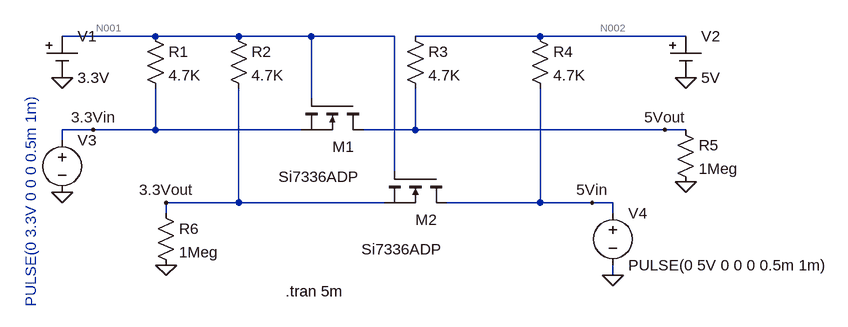
[diagram p0: schematic Logic_Level_Translator.asc]
Logic_Level_Translator.asc, the LTspice schematic file:
Version 4.1
SHEET 1 1036 680
WIRE -16 32 -160 32
WIRE 112 32 -16 32
WIRE 224 32 112 32
WIRE 352 32 224 32
WIRE 576 32 384 32
WIRE 800 32 576 32
WIRE 224 128 224 32
WIRE -112 176 -160 176
WIRE -16 176 -16 112
WIRE -16 176 -112 176
WIRE 208 176 -16 176
WIRE 384 176 384 112
WIRE 384 176 304 176
WIRE 768 176 384 176
WIRE 800 176 768 176
WIRE -160 192 -160 176
WIRE 352 240 352 32
WIRE 112 288 112 112
WIRE 112 288 0 288
WIRE 336 288 112 288
WIRE 576 288 576 112
WIRE 576 288 432 288
WIRE 656 288 576 288
WIRE 688 288 656 288
WIRE 0 304 0 288
WIRE 688 304 688 288
WIRE 688 400 688 384
FLAG 800 96 0
FLAG -160 96 0
FLAG -160 272 0
FLAG 800 256 0
FLAG 688 400 0
FLAG 0 384 0
FLAG 656 288 5Vin
FLAG -112 176 3.3Vin
FLAG 768 176 5Vout
FLAG 0 288 3.3Vout
SYMBOL nmos 304 128 R90
WINDOW 0 74 14 VRight 2
WINDOW 3 120 7 VRight 2
SYMATTR InstName M1
SYMATTR Value Si7336ADP
SYMBOL nmos 432 240 R90
WINDOW 0 74 14 VRight 2
WINDOW 3 120 7 VRight 2
SYMATTR InstName M2
SYMATTR Value Si7336ADP
SYMBOL voltage -160 176 R0
WINDOW 3 194 111 Invisible 2
WINDOW 123 0 0 Left 0
WINDOW 39 0 0 Left 0
SYMATTR InstName V3
SYMATTR Value PULSE(0 3.3V 0 0 0 0.5m 1m)
SYMBOL res -32 16 R0
SYMATTR InstName R1
SYMATTR Value 4.7K
SYMBOL res 96 16 R0
SYMATTR InstName R2
SYMATTR Value 4.7K
SYMBOL res 368 16 R0
SYMATTR InstName R3
SYMATTR Value 4.7K
SYMBOL res 560 16 R0
SYMATTR InstName R4
SYMATTR Value 4.7K
SYMBOL res 784 160 R0
SYMATTR InstName R5
SYMATTR Value 1Meg
SYMBOL Misc\\cell -160 32 R0
WINDOW 123 0 0 Left 0
WINDOW 39 0 0 Left 0
SYMATTR InstName V1
SYMATTR Value 3.3V
SYMBOL Misc\\cell 800 32 R0
WINDOW 123 0 0 Left 0
WINDOW 39 0 0 Left 0
SYMATTR InstName V2
SYMATTR Value 5V
SYMBOL voltage 688 288 R0
WINDOW 123 0 0 Left 0
WINDOW 39 0 0 Left 0
SYMATTR InstName V4
SYMATTR Value PULSE(0 5V 0 0 0 0.5m 1m)
SYMBOL res -16 288 R0
SYMATTR InstName R6
SYMATTR Value 1Meg
TEXT 184 424 Left 2 !.tran 5m
TEXT -208 448 VLeft 2 ;PULSE(0 3.3V 0 0 0 0.5m 1m)

The netlist it stands for:
* Logic_Level_Translator.asc
M1 5Vout N001 3.3Vin 3.3Vin Si7336ADP
M2 5Vin N001 3.3Vout 3.3Vout Si7336ADP
V3 3.3Vin 0 PULSE(0 3.3V 0 0 0 0.5m 1m)
R1 N001 3.3Vin 4.7K
R2 N001 3.3Vout 4.7K
R3 N002 5Vout 4.7K
R4 N002 5Vin 4.7K
R5 5Vout 0 1Meg
V1 N001 0 3.3V
V2 N002 0 5V
V4 5Vin 0 PULSE(0 5V 0 0 0 0.5m 1m)
R6 3.3Vout 0 1Meg
.model NMOS NMOS
.model PMOS PMOS
.lib standard.mos
.tran 5m
* PULSE(0 3.3V 0 0 0 0.5m 1m)
.backanno
.end

* Results of the author's LTspice run, read from the files saved beside the schematic
* Operating Point, zero values left out:
*   V(n001) = 3.3 V
*   V(3.3vout) = 4.689 µV
*   V(5vout) = 7.104 µV
*   V(n002) = 5 V
*   Id(M1) = 1.064 mA
*   Is(M1) = -1.064 mA
*   I(R2) = 702.1 µA
*   I(R3) = 1.064 mA
*   I(R5) = 7.104 pA
*   I(V3) = 1.766 mA
*   I(V4) = 1.766 mA
*   I(R4) = 1.064 mA
*   I(V1) = -1.404 mA
*   I(R6) = 4.689 pA
*   Id(M2) = -702.1 µA
*   Is(M2) = 702.1 µA
*   I(R1) = 702.1 µA
*   I(V2) = -2.128 mA
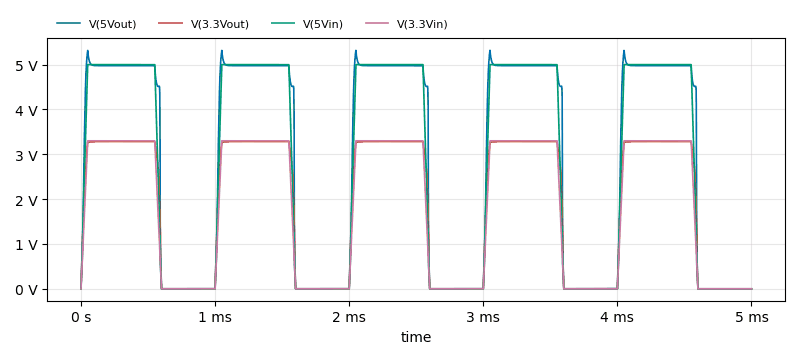
[diagram p1: Transient Analysis of Logic_Level_Translator.asc, plotted from the saved traces]
* Transient Analysis, 1 run:
*   V(5Vout): min 7.03 µV, max 5.317 V, average 2.826 V, rms 3.724 V, last 7.104 µV
*   V(3.3Vout): min 4.411 µV, max 3.285 V, average 1.856 V, rms 2.437 V, last 4.689 µV
*   V(5Vin): min 0 V, max 5 V, average 2.75 V, rms 3.652 V, last 0 V
*   V(3.3Vin): min 0 V, max 3.3 V, average 1.815 V, rms 2.41 V, last 0 V